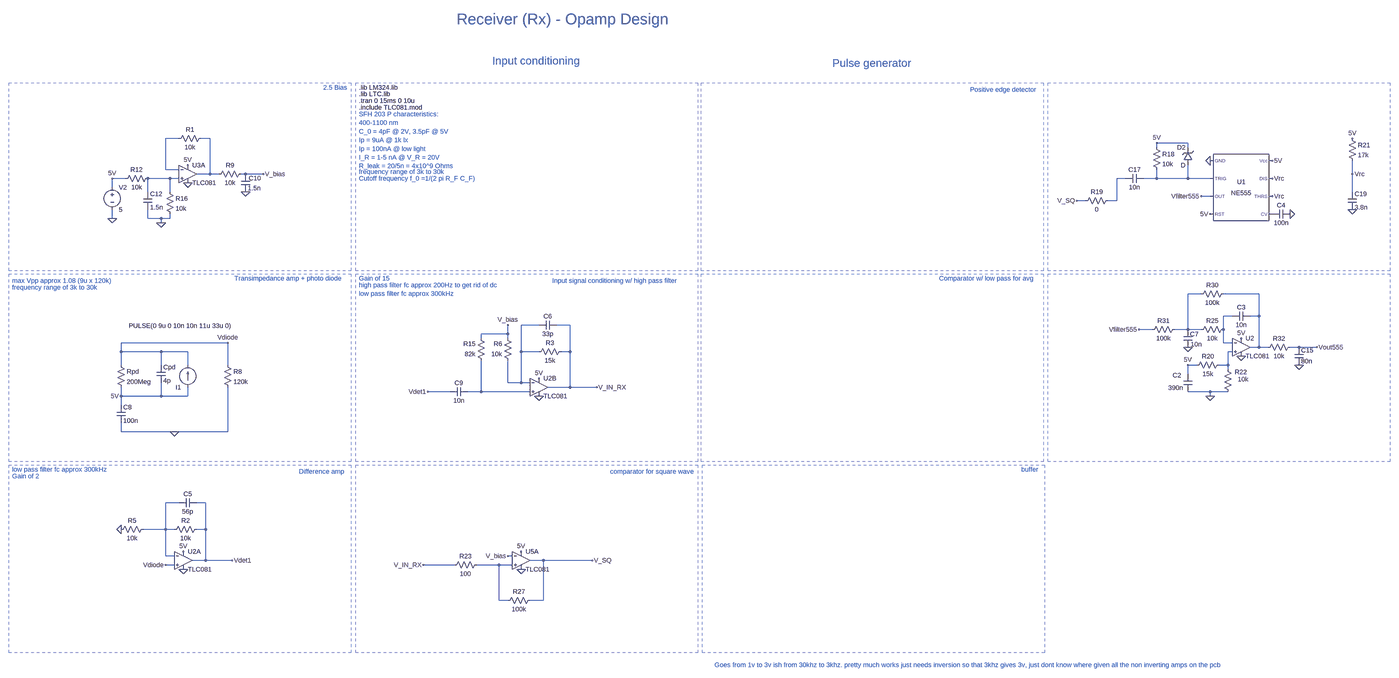
[diagram p0: schematic Opamp based receiver.asc, whole sheet]
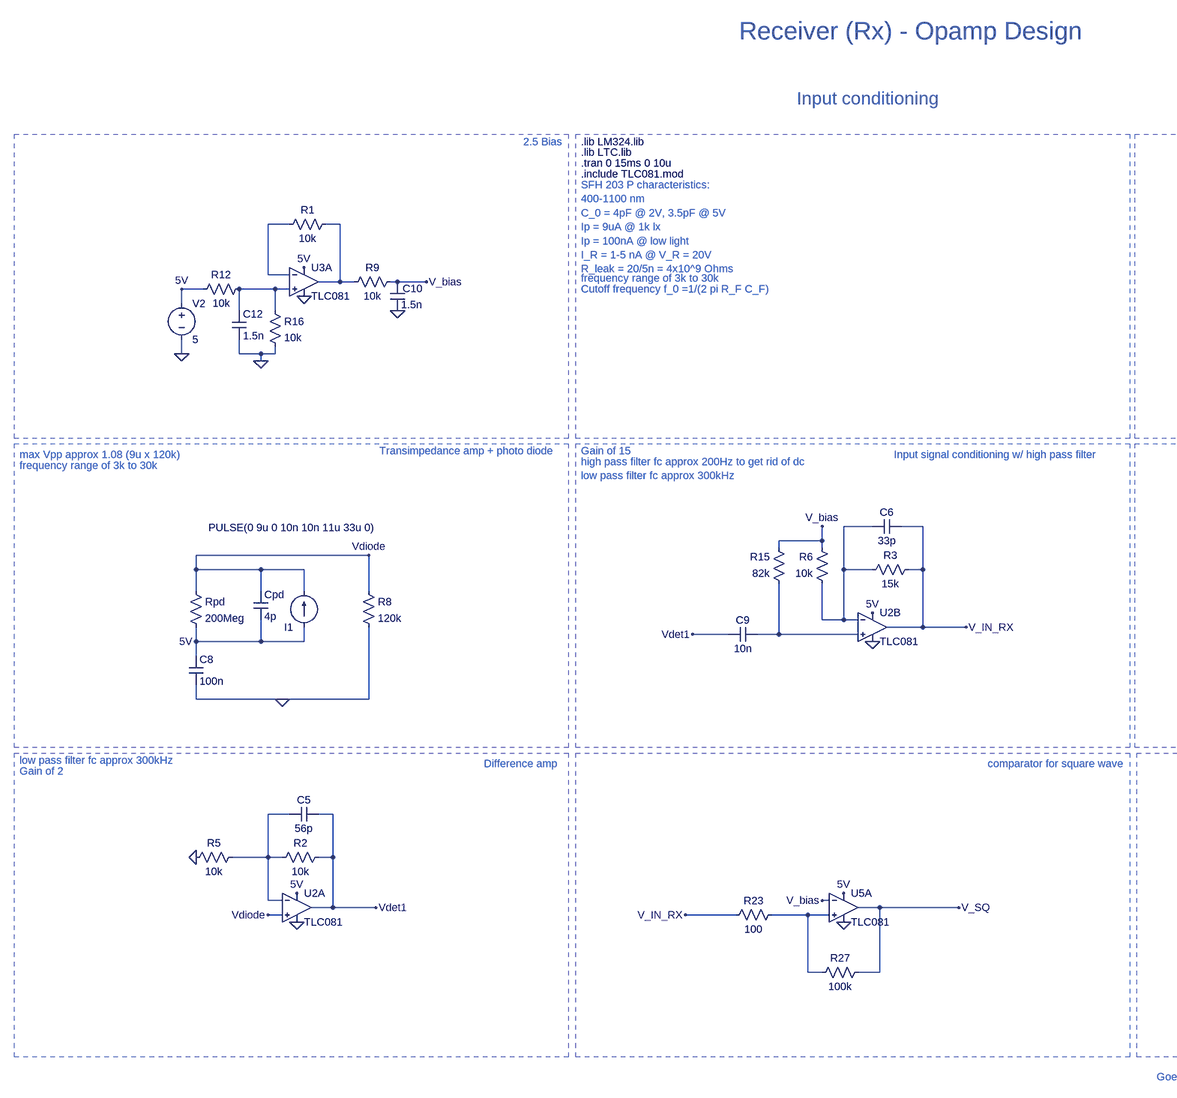
[diagram p1: schematic Opamp based receiver.asc, part, row 1 of 1, column 1 of 2]
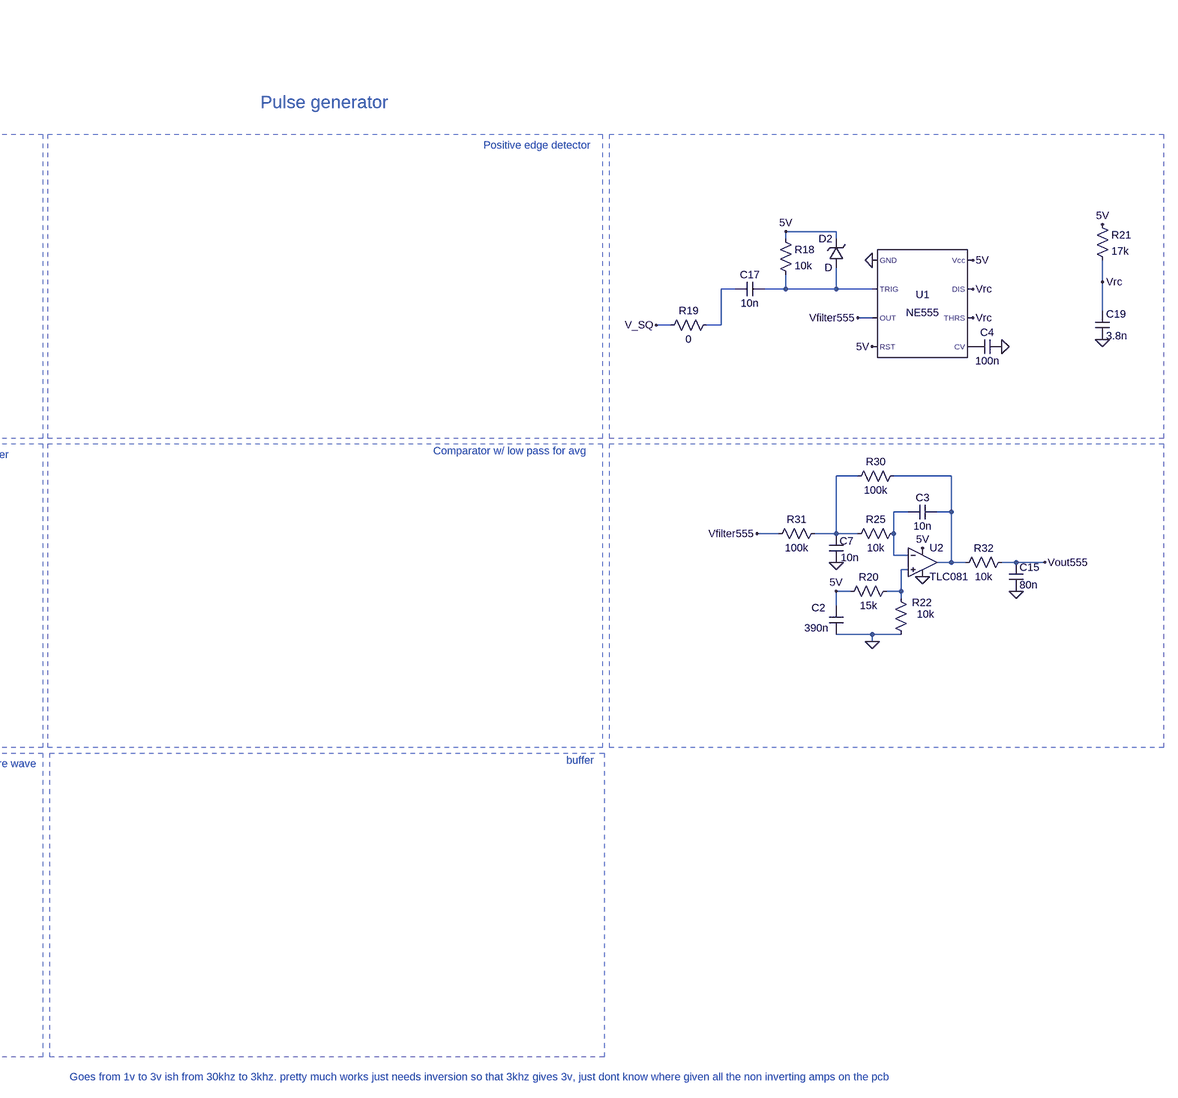
[diagram p2: schematic Opamp based receiver.asc, part, row 1 of 1, column 2 of 2]
Opamp based receiver.asc, the LTspice schematic file:
Version 4.1
SHEET 1 6292 2800
WIRE 1904 256 1856 256
WIRE 2016 256 1984 256
WIRE 5536 272 5424 272
WIRE 5424 288 5424 272
WIRE 5536 288 5536 272
WIRE 1856 368 1856 256
WIRE 1904 368 1856 368
WIRE 2016 384 2016 256
WIRE 2016 384 1968 384
WIRE 2048 384 2016 384
WIRE 2144 384 2128 384
WIRE 2208 384 2144 384
WIRE 6128 384 6128 336
WIRE 1712 400 1664 400
WIRE 1872 400 1792 400
WIRE 1904 400 1872 400
WIRE 5312 400 5280 400
WIRE 5424 400 5424 368
WIRE 5424 400 5376 400
WIRE 5536 400 5536 352
WIRE 5536 400 5424 400
WIRE 5616 400 5536 400
WIRE 1664 432 1664 400
WIRE 1792 448 1792 400
WIRE 1872 448 1872 400
WIRE 6128 448 6128 384
WIRE 5616 464 5584 464
WIRE 5168 480 5136 480
WIRE 5280 480 5280 400
WIRE 5280 480 5248 480
WIRE 1664 544 1664 512
WIRE 1792 544 1792 512
WIRE 1840 544 1792 544
WIRE 1872 544 1872 528
WIRE 1872 544 1840 544
WIRE 1840 560 1840 544
WIRE 5584 816 5536 816
WIRE 5792 816 5664 816
WIRE 5696 896 5664 896
WIRE 5792 896 5792 816
WIRE 5792 896 5760 896
WIRE 3200 928 3136 928
WIRE 3312 928 3264 928
WIRE 5408 944 5360 944
WIRE 5536 944 5536 816
WIRE 5536 944 5488 944
WIRE 5584 944 5536 944
WIRE 5664 944 5664 896
WIRE 3088 960 3088 928
WIRE 3088 960 2992 960
WIRE 2992 976 2992 960
WIRE 3088 976 3088 960
WIRE 2080 992 1696 992
WIRE 5664 992 5664 944
WIRE 5696 992 5664 992
WIRE 5792 1008 5792 896
WIRE 5792 1008 5760 1008
WIRE 5824 1008 5792 1008
WIRE 5936 1008 5904 1008
WIRE 6000 1008 5936 1008
WIRE 1696 1024 1696 992
WIRE 1840 1024 1696 1024
WIRE 1936 1024 1840 1024
WIRE 3136 1024 3136 928
WIRE 3200 1024 3136 1024
WIRE 3312 1024 3312 928
WIRE 3312 1024 3280 1024
WIRE 5696 1024 5680 1024
WIRE 1696 1072 1696 1024
WIRE 1840 1072 1840 1024
WIRE 1936 1072 1936 1024
WIRE 2080 1072 2080 992
WIRE 5568 1072 5536 1072
WIRE 5680 1072 5680 1024
WIRE 5680 1072 5648 1072
WIRE 5680 1088 5680 1072
WIRE 5536 1104 5536 1072
WIRE 3088 1136 3088 1056
WIRE 3136 1136 3136 1024
WIRE 3136 1136 3088 1136
WIRE 3168 1136 3136 1136
WIRE 3312 1152 3312 1024
WIRE 3312 1152 3232 1152
WIRE 3408 1152 3312 1152
WIRE 2880 1168 2800 1168
WIRE 2992 1168 2992 1056
WIRE 2992 1168 2944 1168
WIRE 3168 1168 2992 1168
WIRE 5616 1168 5536 1168
WIRE 5680 1168 5616 1168
WIRE 1696 1184 1696 1152
WIRE 1840 1184 1840 1136
WIRE 1840 1184 1696 1184
WIRE 1936 1184 1936 1152
WIRE 1936 1184 1840 1184
WIRE 5616 1184 5616 1168
WIRE 1696 1216 1696 1184
WIRE 1696 1312 1696 1280
WIRE 1888 1312 1696 1312
WIRE 2080 1312 2080 1152
WIRE 2080 1312 1888 1312
WIRE 1904 1568 1856 1568
WIRE 2000 1568 1968 1568
WIRE 1856 1664 1856 1568
WIRE 1856 1664 1776 1664
WIRE 1888 1664 1856 1664
WIRE 2000 1664 2000 1568
WIRE 2000 1664 1968 1664
WIRE 1856 1760 1856 1664
WIRE 1888 1760 1856 1760
WIRE 3104 1760 3088 1760
WIRE 2000 1776 2000 1664
WIRE 2000 1776 1952 1776
WIRE 2096 1776 2000 1776
WIRE 3216 1776 3168 1776
WIRE 3392 1776 3216 1776
WIRE 1888 1792 1856 1792
WIRE 2896 1792 2784 1792
WIRE 3056 1792 2976 1792
WIRE 3104 1792 3056 1792
WIRE 3056 1920 3056 1792
WIRE 3088 1920 3056 1920
WIRE 3216 1920 3216 1776
WIRE 3216 1920 3168 1920
FLAG 3200 1184 0
FLAG 3408 1152 V_IN_RX
FLAG 3200 1120 5V
FLAG 3136 1808 0
FLAG 3392 1776 V_SQ
FLAG 1664 544 0
FLAG 3088 928 V_bias
FLAG 2800 1168 Vdet1
FLAG 3088 1760 V_bias
FLAG 3136 1744 5V
FLAG 2784 1792 V_IN_RX
FLAG 1888 1312 0
FLAG 1696 1184 5V
FLAG 1920 1808 0
FLAG 1920 1744 5V
FLAG 1856 1792 Vdiode
FLAG 1936 416 0
FLAG 2144 448 0
FLAG 1664 400 5V
FLAG 1936 352 5V
FLAG 2208 384 V_bias
FLAG 2096 1776 Vdet1
FLAG 2080 992 Vdiode
FLAG 1696 1664 0
FLAG 1840 560 0
FLAG 5616 336 0
FLAG 5584 464 Vfilter555
FLAG 5616 528 5V
FLAG 5840 336 5V
FLAG 6128 512 0
FLAG 6128 256 5V
FLAG 6128 384 Vrc
FLAG 5840 400 Vrc
FLAG 5840 464 Vrc
FLAG 5424 272 5V
FLAG 5904 528 0
FLAG 5136 480 V_SQ
FLAG 5536 1072 5V
FLAG 5728 976 5V
FLAG 5728 1040 0
FLAG 5616 1184 0
FLAG 5536 1008 0
FLAG 5936 1072 0
FLAG 5360 944 Vfilter555
FLAG 6000 1008 Vout555
SYMBOL Cap 1824 1072 R0
SYMATTR InstName Cpd
SYMATTR Value 4p
SYMBOL Res 1680 1056 R0
SYMATTR InstName Rpd
SYMATTR Value 200Meg
SYMBOL current 1936 1152 R180
WINDOW 123 0 0 Left 0
WINDOW 39 0 0 Left 0
WINDOW 3 -159 221 Left 2
SYMATTR Value PULSE(0 9u 0 10n 10n 11u 33u 0)
SYMATTR InstName I1
SYMBOL Res 3008 1072 R180
WINDOW 0 36 76 Left 2
WINDOW 3 36 40 Left 2
SYMATTR InstName R15
SYMATTR Value 82k
SYMBOL Res 3104 1072 R180
WINDOW 0 36 76 Left 2
WINDOW 3 36 40 Left 2
SYMATTR InstName R6
SYMATTR Value 10k
SYMBOL opamp2 3200 1088 R0
SYMATTR InstName U2B
SYMATTR Value TLC081
SYMBOL Cap 2944 1152 R90
WINDOW 0 0 32 VBottom 2
WINDOW 3 32 32 VTop 2
SYMATTR InstName C9
SYMATTR Value 10n
SYMBOL Res 3296 1008 R90
WINDOW 0 0 56 VBottom 2
WINDOW 3 32 56 VTop 2
SYMATTR InstName R3
SYMATTR Value 15k
SYMBOL opamp2 3136 1712 R0
SYMATTR InstName U5A
SYMATTR Value TLC081
SYMBOL Res 2992 1776 R90
WINDOW 0 0 56 VBottom 2
WINDOW 3 32 56 VTop 2
SYMATTR InstName R23
SYMATTR Value 100
SYMBOL Res 3184 1904 R90
WINDOW 0 0 56 VBottom 2
WINDOW 3 32 56 VTop 2
SYMATTR InstName R27
SYMATTR Value 100k
SYMBOL voltage 1664 416 R0
WINDOW 123 0 0 Left 0
WINDOW 39 0 0 Left 0
SYMATTR InstName V2
SYMATTR Value 5
SYMBOL cap 1680 1216 R0
SYMATTR InstName C8
SYMATTR Value 100n
SYMBOL res 2064 1056 R0
SYMATTR InstName R8
SYMATTR Value 120k
SYMBOL opamp2 1920 1712 R0
SYMATTR InstName U2A
SYMATTR Value TLC081
SYMBOL Res 1984 1648 R90
WINDOW 0 0 56 VBottom 2
WINDOW 3 32 56 VTop 2
SYMATTR InstName R2
SYMATTR Value 10k
SYMBOL opamp2 1936 320 R0
SYMATTR InstName U3A
SYMATTR Value TLC081
SYMBOL res 2000 240 R90
WINDOW 0 0 56 VBottom 2
WINDOW 3 32 56 VTop 2
SYMATTR InstName R1
SYMATTR Value 10k
SYMBOL res 1856 432 R0
SYMATTR InstName R16
SYMATTR Value 10k
SYMBOL res 2144 368 R90
WINDOW 0 0 56 VBottom 2
WINDOW 3 32 56 VTop 2
SYMATTR InstName R9
SYMATTR Value 10k
SYMBOL res 1808 384 R90
WINDOW 0 0 56 VBottom 2
WINDOW 3 32 56 VTop 2
SYMATTR InstName R12
SYMATTR Value 10k
SYMBOL res 1792 1648 R90
WINDOW 0 0 56 VBottom 2
WINDOW 3 32 56 VTop 2
SYMATTR InstName R5
SYMATTR Value 10k
SYMBOL cap 1968 1552 R90
WINDOW 0 0 32 VBottom 2
WINDOW 3 32 32 VTop 2
SYMATTR InstName C5
SYMATTR Value 56p
SYMBOL cap 3264 912 R90
WINDOW 0 0 32 VBottom 2
WINDOW 3 32 32 VTop 2
SYMATTR InstName C6
SYMATTR Value 33p
SYMBOL cap 1776 448 R0
SYMATTR InstName C12
SYMATTR Value 1.5n
SYMBOL cap 2128 384 R0
WINDOW 0 27 15 Left 2
WINDOW 3 24 51 Left 2
SYMATTR InstName C10
SYMATTR Value 1.5n
SYMBOL Misc\\NE555 5728 432 R0
SYMATTR InstName U1
SYMBOL res 6112 240 R0
SYMATTR InstName R21
SYMATTR Value 17k
SYMBOL cap 6112 448 R0
SYMATTR InstName C19
SYMATTR Value 3.8n
SYMBOL zener 5552 352 R180
WINDOW 0 24 64 Left 2
WINDOW 3 24 0 Left 2
SYMATTR InstName D2
SYMBOL res 5408 272 R0
SYMATTR InstName R18
SYMATTR Value 10k
SYMBOL cap 5376 384 R90
WINDOW 0 0 32 VBottom 2
WINDOW 3 32 32 VTop 2
SYMATTR InstName C17
SYMATTR Value 10n
SYMBOL res 5264 464 R90
WINDOW 0 0 56 VBottom 2
WINDOW 3 32 56 VTop 2
SYMATTR InstName R19
SYMATTR Value 0
SYMBOL cap 5904 512 R90
WINDOW 0 0 32 VBottom 2
WINDOW 3 32 32 VTop 2
SYMATTR InstName C4
SYMATTR Value 100n
SYMBOL opamp2 5728 944 R0
SYMATTR InstName U2
SYMATTR Value TLC081
SYMBOL res 5664 1056 R90
WINDOW 0 0 56 VBottom 2
WINDOW 3 32 56 VTop 2
SYMATTR InstName R20
SYMATTR Value 15k
SYMBOL res 5696 1184 R180
WINDOW 0 -53 87 Left 2
WINDOW 3 -58 61 Left 2
SYMATTR InstName R22
SYMATTR Value 10k
SYMBOL cap 5520 1104 R0
WINDOW 0 -39 5 Left 2
WINDOW 3 -55 50 Left 2
SYMATTR InstName C2
SYMATTR Value 390n
SYMBOL cap 5760 880 R90
WINDOW 0 0 32 VBottom 2
WINDOW 3 32 32 VTop 2
SYMATTR InstName C3
SYMATTR Value 10n
SYMBOL res 5680 928 R90
WINDOW 0 0 56 VBottom 2
WINDOW 3 32 56 VTop 2
SYMATTR InstName R25
SYMATTR Value 10k
SYMBOL cap 5520 944 R0
WINDOW 0 24 17 Left 2
WINDOW 3 26 53 Left 2
SYMATTR InstName C7
SYMATTR Value 10n
SYMBOL res 5680 800 R90
WINDOW 0 0 56 VBottom 2
WINDOW 3 32 56 VTop 2
SYMATTR InstName R30
SYMATTR Value 100k
SYMBOL res 5504 928 R90
WINDOW 0 0 56 VBottom 2
WINDOW 3 32 56 VTop 2
SYMATTR InstName R31
SYMATTR Value 100k
SYMBOL res 5920 992 R90
WINDOW 0 0 56 VBottom 2
WINDOW 3 32 56 VTop 2
SYMATTR InstName R32
SYMATTR Value 10k
SYMBOL cap 5920 1008 R0
WINDOW 0 24 11 Left 2
WINDOW 3 24 50 Left 2
SYMATTR InstName C15
SYMATTR Value 80n
TEXT 2552 72 Left 2 !.lib LM324.lib
TEXT 2552 120 Left 2 !.tran 0 15ms 0 10u
TEXT 2552 96 Left 2 !.lib LTC.lib
TEXT 2552 144 Left 2 !.include TLC081.mod
TEXT 3032 -24 Left 4 ;Input conditioning
TEXT 3248 768 Left 2 ;Input signal conditioning w/ high pass filter
TEXT 2904 -328 Left 5 ;Receiver (Rx) - Opamp Design
TEXT 4752 80 Left 2 ;Positive edge detector
TEXT 3456 1456 Left 2 ;comparator for square wave
TEXT 4256 -16 Left 4 ;Pulse generator
TEXT 4640 760 Left 2 ;Comparator w/ low pass for avg
TEXT 2552 168 Left 2 ;SFH 203 P characteristics:\n400-1100 nm\nC_0 = 4pF @ 2V, 3.5pF @ 5V\nIp = 9uA @ 1k lx\nIp = 100nA @ low light\nI_R = 1-5 nA @ V_R = 20V\nR_leak = 20/5n = 4x10^9 Ohms
TEXT 2552 400 Left 2 ;Cutoff frequency f_0 =1/(2 pi R_F C_F)
TEXT 4936 1448 Left 2 ;buffer
TEXT 2552 376 Left 2 ;frequency range of 3k to 30k
TEXT 2552 760 Left 2 ;Gain of 15
TEXT 2552 784 Left 2 ;high pass filter fc approx 200Hz to get rid of dc\nlow pass filter fc approx 300kHz
TEXT 3832 2152 Left 2 ;Goes from 1v to 3v ish from 30khz to 3khz. pretty much works just needs inversion so that 3khz gives 3v, just dont know where given all the non inverting amps on the pcb
TEXT 2424 72 Left 2 ;2.5 Bias
TEXT 2104 760 Left 2 ;Transimpedance amp + photo diode
TEXT 2336 1456 Left 2 ;Difference amp
TEXT 1304 1448 Left 2 ;low pass filter fc approx 300kHz
TEXT 1304 1472 Left 2 ;Gain of 2
TEXT 1304 768 Left 2 ;max Vpp approx 1.08 (9u x 120k)
TEXT 1304 792 Left 2 ;frequency range of 3k to 30k
RECTANGLE Normal 2540 56 3772 732 2
RECTANGLE Normal 2540 744 3772 1420 2
RECTANGLE Normal 3784 56 5016 732 2
RECTANGLE Normal 3784 744 5016 1420 2
RECTANGLE Normal 2540 1432 3772 2108 2
RECTANGLE Normal 3788 1432 5020 2108 2
RECTANGLE Normal 1292 56 2524 732 2
RECTANGLE Normal 1292 744 2524 1420 2
RECTANGLE Normal 1292 1432 2524 2108 2
RECTANGLE Normal 5032 56 6264 732 2
RECTANGLE Normal 5032 744 6264 1420 2

The netlist it stands for:
* Opamp based receiver.asc
Cpd Vdiode 5V 4p
Rpd Vdiode 5V 200Meg
I1 5V Vdiode PULSE(0 9u 0 10n 10n 11u 33u 0)
R15 N011 V_bias 82k
R6 N009 V_bias 10k
X§U2B N011 N009 5V 0 V_IN_RX TLC081  ; pins In+ In- V+ V- OUT
C9 N011 Vdet1 10n
R3 V_IN_RX N009 15k
X§U5A N013 V_bias 5V 0 V_SQ TLC081  ; pins In+ In- V+ V- OUT
R23 N013 V_IN_RX 100
R27 V_SQ N013 100k
V2 5V 0 5
C8 5V 0 100n
R8 Vdiode 0 120k
X§U2A Vdiode N012 5V 0 Vdet1 TLC081  ; pins In+ In- V+ V- OUT
R2 Vdet1 N012 10k
X§U3A N003 N001 5V 0 N002 TLC081  ; pins In+ In- V+ V- OUT
R1 N002 N001 10k
R16 N003 0 10k
R9 V_bias N002 10k
R12 N003 5V 10k
R5 N012 0 10k
C5 Vdet1 N012 56p
C6 V_IN_RX N009 33p
C12 N003 0 1.5n
C10 V_bias 0 1.5n
X§U1 0 N005 Vfilter555 5V P001 Vrc Vrc 5V NE555  ; pins GND TRIG OUT RST CV THRS DIS Vcc
R21 5V Vrc 17k
C19 Vrc 0 3.8n
D2 N005 5V D
R18 5V N005 10k
C17 N005 N004 10n
R19 N004 V_SQ 0
C4 0 P001 100n
X§U2 N010 N008 5V 0 N007 TLC081  ; pins In+ In- V+ V- OUT
R20 N010 5V 15k
R22 0 N010 10k
C2 5V 0 390n
C3 N007 N008 10n
R25 N008 N006 10k
C7 N006 0 10n
R30 N007 N006 100k
R31 N006 Vfilter555 100k
R32 Vout555 N007 10k
C15 Vout555 0 80n
.model D D
.lib standard.dio
.lib LM324.lib
.tran 0 15ms 0 10u
.lib LTC.lib
.include TLC081.mod
* Input conditioning
* Input signal conditioning w/ high pass filter
* Receiver (Rx) - Opamp Design
* Positive edge detector
* comparator for square wave
* Pulse generator
* Comparator w/ low pass for avg
* SFH 203 P characteristics:
* 400-1100 nm
* C_0 = 4pF @ 2V, 3.5pF @ 5V
* Ip = 9uA @ 1k lx
* Ip = 100nA @ low light
* I_R = 1-5 nA @ V_R = 20V
* R_leak = 20/5n = 4x10^9 Ohms
* Cutoff frequency f_0 =1/(2 pi R_F C_F)
* buffer
* frequency range of 3k to 30k
* Gain of 15
* high pass filter fc approx 200Hz to get rid of dc
* low pass filter fc approx 300kHz
* Goes from 1v to 3v ish from 30khz to 3khz. pretty much works just needs inversion so that 3khz gives 3v, just dont know where given all the non inverting amps on the pcb
* 2.5 Bias
* Transimpedance amp + photo diode
* Difference amp
* low pass filter fc approx 300kHz
* Gain of 2
* max Vpp approx 1.08 (9u x 120k)
* frequency range of 3k to 30k
.lib NE555.sub
.backanno
.end